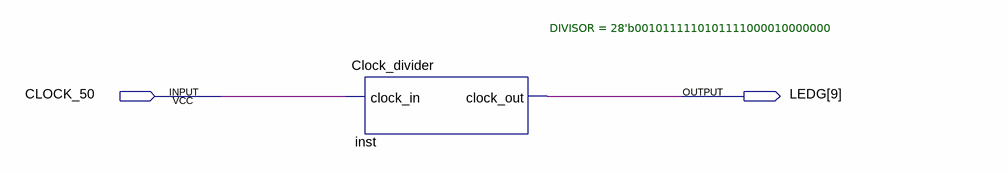
[diagram p0: schematic sheet]
// Quartus schematic ClockDividerTest.bdf as structural Verilog: 1 symbols, 2 pins
module ClockDividerTest (
  input  CLOCK_50,
  output [9:9] LEDG
);

  Clock_divider #(.DIVISOR(28'b0010111110101111000010000000)) inst (.clock_in(CLOCK_50), .clock_out(LEDG[9]));
endmodule
